# Altium schematic sheet MCU.SchDoc
size A3; SheetNumber: 1; SheetTotal: 8
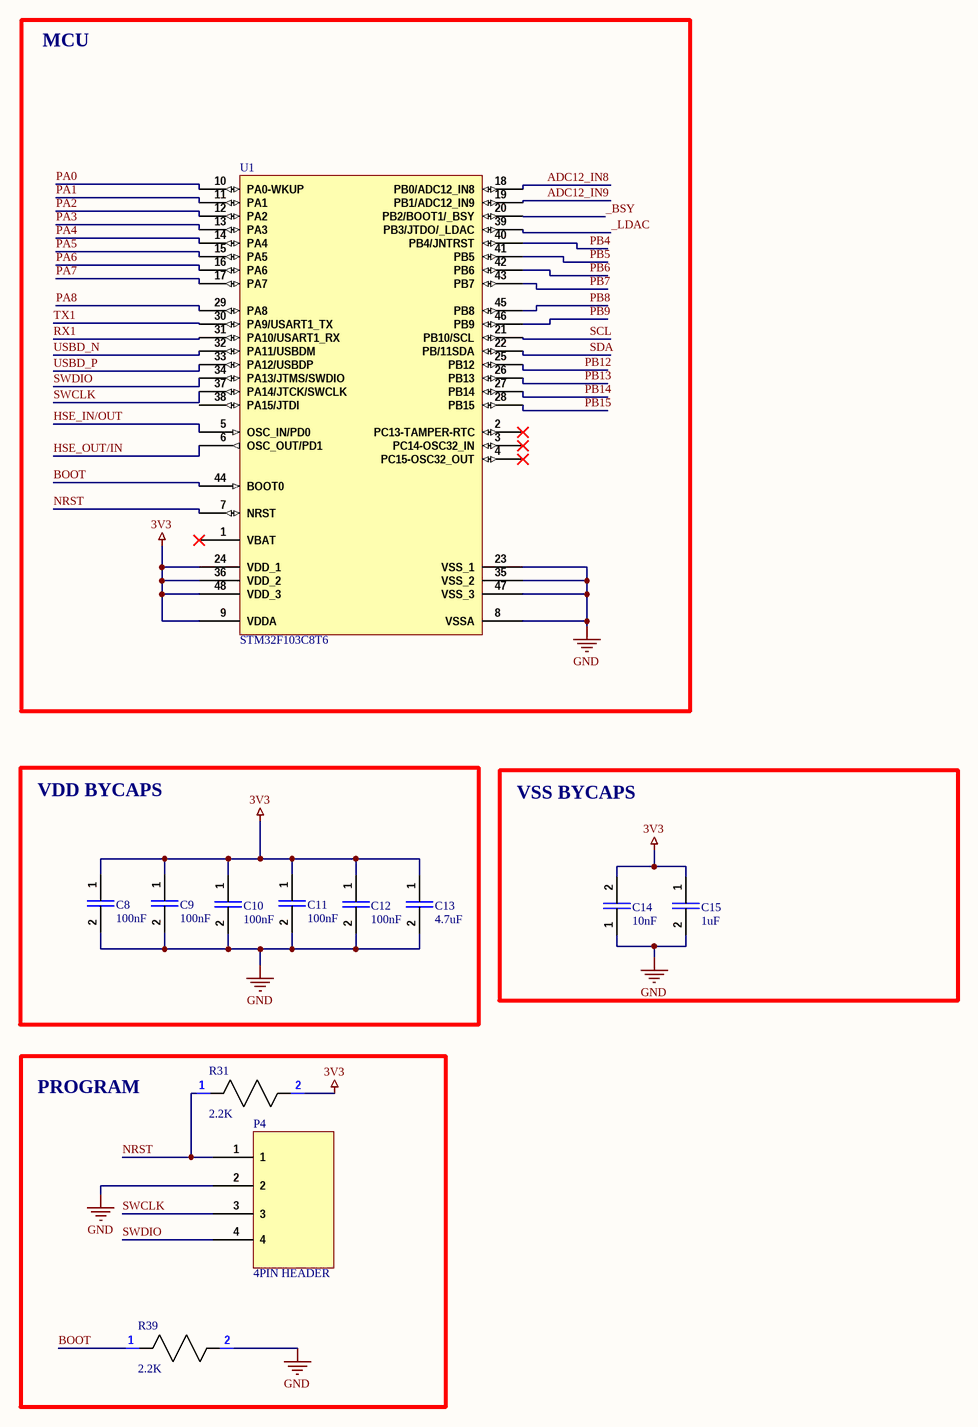
[diagram p0: MCU.SchDoc]

## Parts
C8  value 100nF  [0603 Cap]  (hidden comment: 0603 Capacitor)
C9  value 100nF  [0603 Cap]  (hidden comment: 0603 Capacitor)
C10  value 100nF  [0603 Cap]  (hidden comment: 0603 Capacitor)
C11  value 100nF  [0603 Cap]  (hidden comment: 0603 Capacitor)
C12  value 100nF  [0603 Cap]  (hidden comment: 0603 Capacitor)
C13  value 4.7uF  [0603 Cap]  (hidden comment: 0603 Capacitor)
C14  value 10nF  [0603 Cap]  (hidden comment: 0603 Capacitor)
C15  value 1uF  [0603 Cap]  (hidden comment: 0603 Capacitor)
P4  4PIN HEADER  [SM04B-SRSS-TB]
R31  value 2.2K  [0603 RES]  (hidden comment: Resistor)
R39  value 2.2K  [0603 RES]  (hidden comment: Resistor)
U1  STM32F103C8T6  [LQFP48_N]

## Blocks framed on the sheet
MCU: U1
VDD BYCAPS: C8-C13
VSS BYCAPS: C14 C15
PROGRAM: P4 R31 R39

## Nets
3V3: C8.1 C9.1 C10.1 C11.1 C12.1 C13.1 C14.2 C15.1 R31.2 U1.9(VDDA) U1.24(VDD_1) U1.36(VDD_2) U1.48(VDD_3)
GND: C8.2 C9.2 C10.2 C11.2 C12.2 C13.2 C14.1 C15.2 P4.2 R39.2 U1.8(VSSA) U1.23(VSS_1) U1.35(VSS_2) U1.47(VSS_3)
_BSY: U1.20(PB2/BOOT1/_BSY)
_LDAC: U1.39(PB3/JTDO/_LDAC)
ADC12_IN8: U1.18(PB0/ADC12_IN8)
ADC12_IN9: U1.19(PB1/ADC12_IN9)
BOOT: R39.1 U1.44(BOOT0)
HSE_IN/OUT: U1.5(OSC_IN/PD0)
HSE_OUT/IN: U1.6(OSC_OUT/PD1)
NRST: P4.1 R31.1 U1.7(NRST)
PA0: U1.10(PA0-WKUP)
PA1: U1.11(PA1)
PA2: U1.12(PA2)
PA3: U1.13(PA3)
PA4: U1.14(PA4)
PA5: U1.15(PA5)
PA6: U1.16(PA6)
PA7: U1.17(PA7)
PA8: U1.29(PA8)
PB4: U1.40(PB4/JNTRST)
PB5: U1.41(PB5)
PB6: U1.42(PB6)
PB7: U1.43(PB7)
PB8: U1.45(PB8)
PB9: U1.46(PB9)
PB12: U1.25(PB12)
PB13: U1.26(PB13)
PB14: U1.27(PB14)
PB15: U1.28(PB15)
RX1: U1.31(PA10/USART1_RX)
SCL: U1.21(PB10/SCL)
SDA: U1.22(PB/11SDA)
SWCLK: P4.3 U1.37(PA14/JTCK/SWCLK)
SWDIO: P4.4 U1.34(PA13/JTMS/SWDIO)
TX1: U1.30(PA9/USART1_TX)
USBD_N: U1.32(PA11/USBDM)
USBD_P: U1.33(PA12/USBDP)

Not connected (* = marked no-connect by the designer): U1 1(VBAT)* 2(PC13-TAMPER-RTC)* 3(PC14-OSC32_IN)* 4(PC15-OSC32_OUT)* 38(PA15/JTDI)

## Library data of the parts
C8-C15 = 0603 Cap: SMD 0603 (ceramic) capacitor; Manufacturer: Murata; Manufacturer Part Number: GRM21BR71C225KA12L; Multilayer: Yes; Tolerance  (fill in as +-): 10%; Rated DC Voltage (URdc): 16V; Temperature Characteristics Code: X7R; Supplier: Mouser; Supplier Part Number: 81-GRM21BR71C225KA2L; RoHS: Yes; Category: Ceramic Capacitors; Stock: 30148; Pricing: 1=0,3, 10=0,163, 50=0,163, 100=0,098, 1000=0,07, 10000=0,054 (USD); Mounting Technology: Surface Mount; Pins: 2; Package Shape: Rectangular; Terminal Finish: Nickel; Dielectric Material: Ceramic; Case/Package: 0805; Min Operating Temperature: -55°C; Max Operating Temperature: 125°C; JESD-609 Code: e3; Package Style: SMTMeter; Capacitor Type: Ceramic; Packaging: Tape and Reel; Tolerance (fill in as +-): 10%; Termination: Wraparound; Length: 2mm; Width: 1.25mm; Height: 1.25mm; Reach SVHC Compliant: Yes; RoHS Compliant: Yes; ComponentLink1URL: https://datasheet.ciiva.com:443/pdfs/VipMasterIC/IC/MURE/MURE-S-A0004349797/MURE-S-A0004361718-1.pdf?src-supplier=IHS+Markit; ComponentLink1Description: https://datasheet.ciiva.com:443/pdfs/VipMasterIC/IC/MURE/MURE-S-A0004349797/MURE-S-A0004361718-1.pdf?src-supplier=IHS+Markit; ComponentLink2URL: https://datasheet.ciiva.com/7937/608985-7937701.pdf?src-supplier=Element14; ComponentLink2Description: https://datasheet.ciiva.com/7937/608985-7937701.pdf?src-supplier=Element14
P4 = 4X HEADER
R31 R39 = 0603 Res: Can be used for SMD resistors
U1 = STM32F103C8T6: STM32 ARM-based 32-bit MCU with 64 Kbytes Flash, 48-pin LQFP, Industrial Temperature; Published: 30-May-2008; DatasheetVersion: rev6, Mar-2008; PackageVersion: Mar-2008; PackageReference: LQFP48; Publisher: Altium Limited; PackageDescription: 48-Pin Low-Profile Quad Flat Pack, 7 x 7 mm Body, 0.5 mm Pitch (LQFP48); ComponentLink1Description: Manufacturer Link; ComponentLink1URL: www.st.com/stm32; ComponentLink2Description: Datasheet; ComponentLink2URL: http://www.st.com/stonline/products/literature/ds/13587.pdf